# EAGLE design STorM32 NT imu v11-mpu9250 (EAGLE 6.5.0)
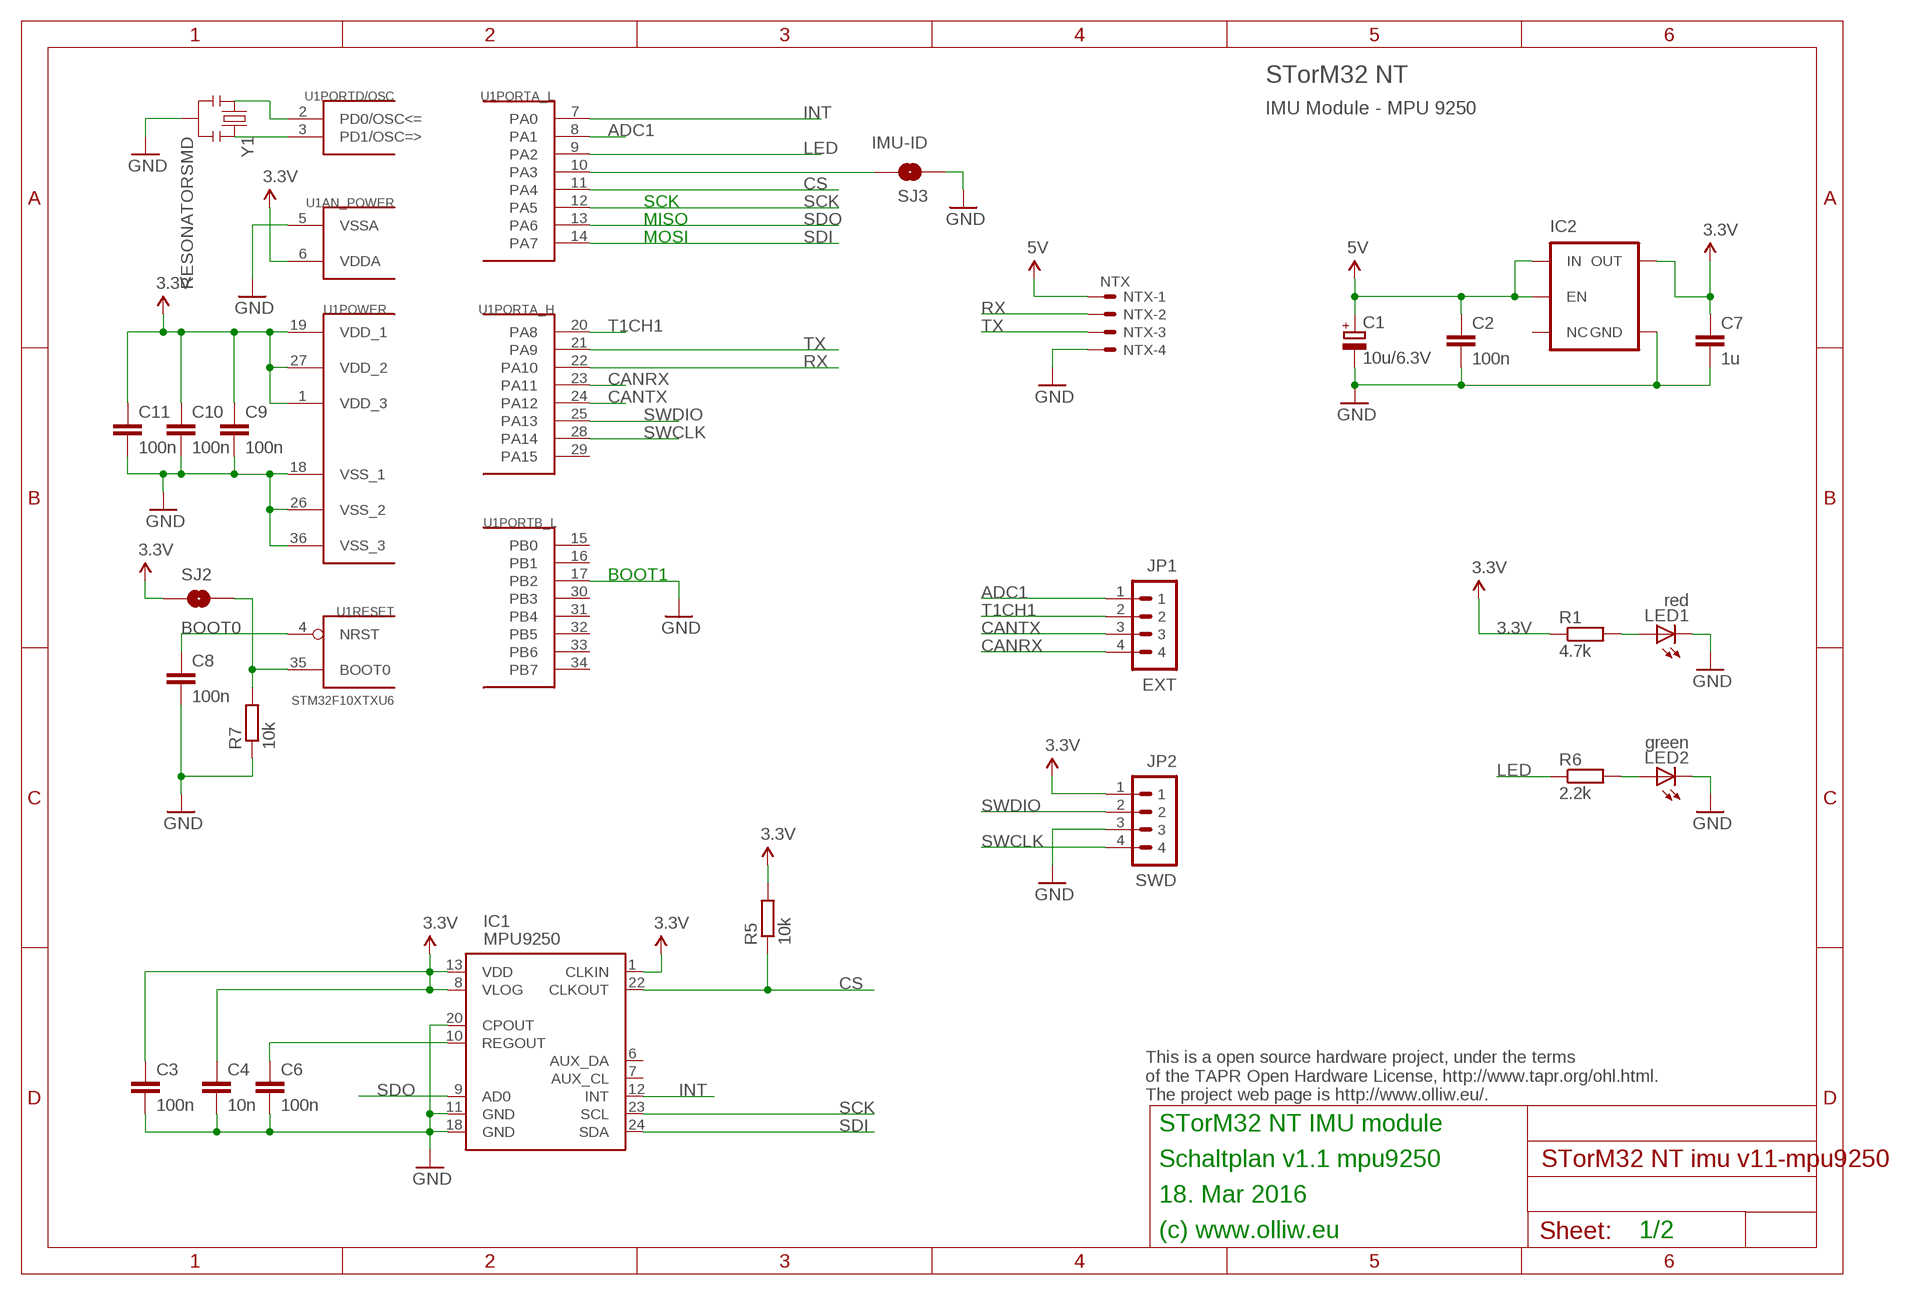
[diagram p0: schematic, sheet 1]

## Parts
C1  10u/6.3V  CPOL-EUSMCB  [SMC_B]
C2  100n  C-EUC0603  [C0603]
C3  100n  C-EUC0603  [C0603]
C4  10n  C-EUC0603  [C0603]
C6  100n  C-EUC0603  [C0603]
C7  1u  C-EUC0603  [C0603]
C8  100n  C-EUC0603  [C0603]
C9  100n  C-EUC0603  [C0603]
C10  100n  C-EUC0603  [C0603]
C11  100n  C-EUC0603  [C0603]
IC1  MPU9250  IMU3000QFN-24-0.4MIL  [QFN-24-3X3]
IC2  V_REG_TPS76433SOT23-5  [SOT23-5]
JP1  EXT  P4X1_1P27-OCT_BILEX  [4X1_1P27_OCT_BILEX]
JP2  SWD  P4X1_1P27-OCT_BILEX  [4X1_1P27_OCT_BILEX]
LED1  red  LEDCHIPLED_0603  [CHIPLED_0603]
LED2  green  LEDCHIPLED_0603  [CHIPLED_0603]
NTX  NTX  SM04B-SRSS-TB  [SM04B-SRSS-TB]
R1  4.7k  R-EU_R0603  [R0603]
R5  10k  R-EU_R0603  [R0603]
R6  2.2k  R-EU_R0603  [R0603]
R7  10k  R-EU_R0603  [R0603]
SJ2  BOOT0  SOLDERJUMPERNO  [SJ_2S-NO]
SJ3  IMU-ID  SOLDERJUMPERNO  [SJ_2S-NO]
U1  STM32F10XTXU6  [VFQFPN36]
Y1  RESONATORSMD  [RESONATOR-SMD]

## Nets
3.3V: C3.1 C4.1 C7.1 C9.1 C10.1 C11.1 IC1.1(CLKIN) IC1.8(VLOG) IC1.13(VDD) IC2.5(OUT) JP2.1 R1.1 R5.2 SJ2.1 U1.1(POWER:VDD_3) U1.6(AN_POWER:VDDA) U1.19(POWER:VDD_1) U1.27(POWER:VDD_2)
5V: C1.+ C2.1 IC2.1(IN) IC2.3(EN) NTX.1
ADC1: JP1.1 U1.8(PORTA_L:PA1)
CANRX: JP1.4 U1.23(PORTA_H:PA11)
CANTX: JP1.3 U1.24(PORTA_H:PA12)
CS: IC1.22(CLKOUT) R5.1 U1.11(PORTA_L:PA4)
GND: C1.- C2.2 C3.2 C4.2 C6.2 C7.2 C8.2 C9.2 C10.2 C11.2 IC1.11(GND) IC1.18(GND) IC1.20(CPOUT) IC2.2(GND) JP2.3 LED1.C LED2.C NTX.4 R7.1 SJ3.1 U1.5(AN_POWER:VSSA) U1.17(PORTB_L:PB2) U1.18(POWER:VSS_1) U1.26(POWER:VSS_2) U1.36(POWER:VSS_3) Y1.2
INT: IC1.12(INT) U1.7(PORTA_L:PA0)
LED: R6.1 U1.9(PORTA_L:PA2)
N$1: C8.1 U1.4(RESET:NRST)
N$2: LED2.A R6.2
N$3: R7.2 SJ2.2 U1.35(RESET:BOOT0)
N$4: SJ3.2 U1.10(PORTA_L:PA3)
N$5: U1.2(PORTD/OSC:PD0/OSC<=) Y1.1
N$6: U1.3(PORTD/OSC:PD1/OSC=>) Y1.3
N$9: LED1.A R1.2
N$20: C6.1 IC1.10(REGOUT)
RX: NTX.2 U1.22(PORTA_H:PA10)
SCK: IC1.23(SCL) U1.12(PORTA_L:PA5)
SDI: IC1.24(SDA) U1.14(PORTA_L:PA7)
SDO: IC1.9(AD0) U1.13(PORTA_L:PA6)
SWCLK: JP2.4 U1.28(PORTA_H:PA14)
SWDIO: JP2.2 U1.25(PORTA_H:PA13)
T1CH1: JP1.2 U1.20(PORTA_H:PA8)
TX: NTX.3 U1.21(PORTA_H:PA9)
Unconnected: IC1.6(AUX_DA) IC1.7(AUX_CL) IC2.4(NC) U1.15(PORTB_L:PB0) U1.16(PORTB_L:PB1) U1.29(PORTA_H:PA15) U1.30(PORTB_L:PB3) U1.31(PORTB_L:PB4) U1.32(PORTB_L:PB5) U1.33(PORTB_L:PB6) U1.34(PORTB_L:PB7)

## Notes on the sheet
- STorM32 NT
- IMU Module - MPU 9250
- SCK
- MISO
- MOSI
- BOOT1
- This is a open source hardware project, under the terms
  of the TAPR Open Hardware License, http://www.tapr.org/ohl.html.
  The project web page is http://www.olliw.eu/.
- STorM32 NT IMU module
- Schaltplan v1.1 mpu9250
- 18. Mar 2016
- (c) www.olliw.eu | 1/2

## Library data of the parts
C1 = rcl:CPOL-EU: POLARIZED CAPACITOR, European symbol
C2-C4 C6-C11 = rcl:C-EU: CAPACITOR, European symbol
IC1 = # SparkFun2:IMU3000
IC2 = # SparkFun2:V_REG_TPS76433: Voltage Regulator Older TI part. LDO 150mA regulator. No output by-pass cap option. See V_REG_LDO for a better part.
JP1 JP2 = # stdlib:P4X1_1P27
LED1 LED2 = led:LED: LED OSRAM: - CHIPLED LG R971, LG N971, LY N971, LG Q971, LY Q971, LO R971, LY R971 LH N974, LH R974 LS Q976, LO Q976, LY Q976 LO Q996 - Hyper CHIPLED LW Q18S LB Q993, LB Q99A, LB R99A - SideLED LS A670, LO A670, LY A670, LG A670, LP A670 LB A673, LV A673, LT A673, LW A673 LH A674 LY A675 LS A676, LA A676, LO A676, LY A676, LW A676 LS A679, LY A679, LG A679 - Hyper Micro SIDELED® LS Y876, LA Y876, LO Y876, LY Y876 LT Y87S - SmartLED LW L88C, LW L88S LB L89C, LB L89S, LG L890 LS L89K, LO L89K, LY L89K LS L896, LA L896, LO L896, LY L896 - TOPLED LS T670, LO T670, LY T670, LG T670, LP T670 LSG T670, LSP T670, LSY T670, LOP T670, LYG T670 LG T671, LOG T671, LSG T671 LB T673, LV T673, LT T673, LW T673 LH T674 LS T676, LA T676, LO T676, LY T676, LB T676, LH T676, LSB T676, LW T676 LB T67C, LV T67C, LT T67C, LS T67K, LO T67K, LY T67K, LW E67C LS E67B, LA E67B, LO E67B, LY E67B, LB E67C, LV E67C, LT E67C LW T67C LS T679, LY T679, LG T679 LS T770, LO T770, LY T770, LG T770, LP T770 LB T773, LV T773, LT T773, LW T773 LH T774 LS E675, LA E675, LY E675, LS T675 LS T776, LA T776, LO T776, LY T776, LB T776 LHGB T686 LT T68C, LB T68C - Hyper Mini TOPLED® LB M676 - Mini TOPLED Santana® LG M470 LS M47K, LO M47K, LY M47K Source: http://www.osram.convergy.de LUXEON: - LUMILED® LXK2-PW12-R00, LXK2-PW12-S00, LXK2-PW14-U00, LXK2-PW14-V00 LXK2-PM12-R00, LXK2-PM12-S00, LXK2-PM14-U00 LXK2-PE12-Q00, LXK2-PE12-R00, LXK2-PE12-S00, LXK2-PE14-T00, LXK2-PE14-U00 LXK2-PB12-K00, LXK2-PB12-L00, LXK2-PB12-M00, LXK2-PB14-N00, LXK2-PB14-P00, LXK2-PB14-Q00 LXK2-PR12-L00, LXK2-PR12-M00, LXK2-PR14-Q00, LXK2-PR14-R00 LXK2-PD12-Q00, LXK2-PD12-R00, LXK2-PD12-S00 LXK2-PH12-R00, LXK2-PH12-S00 LXK2-PL12-P00, LXK2-PL12-Q00, LXK2-PL12-R00 Source: www.luxeon.com KINGBRIGHT: KA-3528ASYC Source: www.kingbright.com
NTX = con-jst2:?M04B-SRSS-TB: Disconnectable Crimp style connector, 1.0mm pitch 4 contacts
R1 R5-R7 = rcl:R-EU_: RESISTOR, European symbol
SJ2 SJ3 = # SparkFun2:SOLDERJUMPER: Solder Jumper Standard SMD solder jumper. Used to automate production. Two varients : Normally Open and Normally Closed are the same, but have different paste layers. NC will have a large amount of paste and should jumper during reflow.
U1 = # stm32:STM32F10XTXU6: STM32F101/103 36pad VFQPFN36
Y1 = # SparkFun2:RESONATOR: Resonator Small SMD resonator. This is the itty bitty 10/20MHz resonators with built in caps. CSTCE10M0G55 and CSTCE20M0V53. Footprint has been reviewed closely but hasn't been tested yet.

## Board
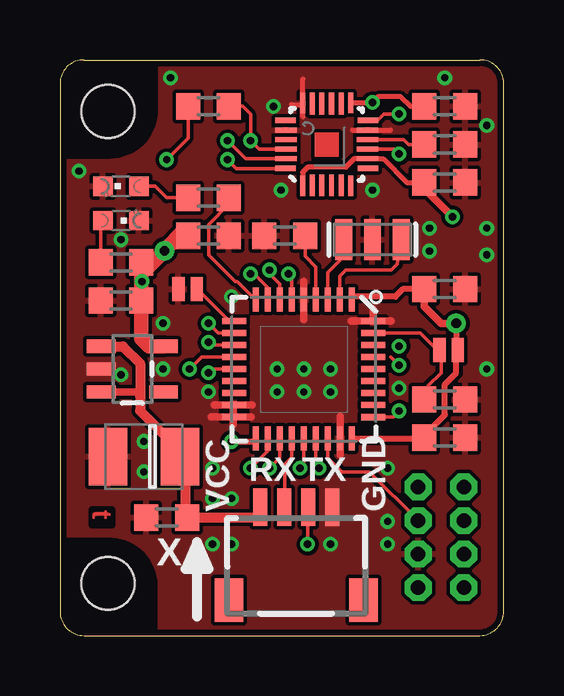
[diagram p1: board, top side]
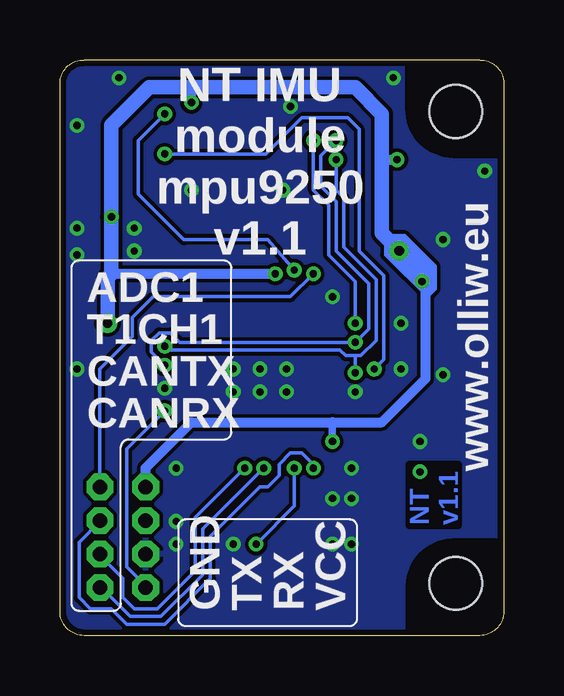
[diagram p2: board, bottom side, seen from below]

Size 18.49 x 24 mm. Coordinates in mm from the lower left corner, seen from the top.
Outline: 1,24 17.49,24 arc-90 18.49,23.03 18.49,1 arc-90 17.49,0 1,0 arc-90 0,1 0,23.03 arc-90 1,24
Copper layers (1*16): Top 0.035mm / dielectric 1.5mm / Bottom 0.035mm
Design rules "Fusion_eagle_rule_v1.1-shapes-supply-changed": minimum track width 6mil, minimum drill 12mil, track to track 6mil, track to pad 6mil, pad to pad 6mil, via to via 6mil, smd to smd 0mil, copper to edge 10mil, drill to drill 10mil, minimum pad ring 10mil, minimum via ring 6mil, stop-mask expansion 2mil, vias tented up to drill 100mil, thermal gap 6mil
Holes 2.2 mm at 2,2.17 2,21.86

### Footprints (pad centres in the part's own frame; a part is rotated, then mirrored left to right if it is on the bottom)
SMC_B = smd 1.6 x 2.4: + -1.5,0; - 1.5,0
C0603 = smd 1 x 1.1: 1 -0.85,0; 2 0.85,0
QFN-24-3X3 = smd 0.85 x 0.21: 1 -1.725,1; 6 -1.725,-1; 13 1.725,-1; 18 1.725,1 | smd 0.9 x 0.21: 2 -1.7,0.6; 3 -1.7,0.2; 5 -1.7,-0.6; 14 1.7,-0.6; 15 1.7,-0.2; 16 1.7,0.2; 17 1.7,0.6 | smd 0.9 x 0.2: 4 -1.7,-0.2 | smd 0.21 x 0.85: 7 -1,-1.725; 12 1,-1.725; 19 1,1.725; 24 -1,1.725 | smd 0.21 x 0.9: 8 -0.6,-1.7; 9 -0.2,-1.7; 10 0.2,-1.7; 11 0.6,-1.7; 20 0.6,1.7; 21 0.2,1.7; 22 -0.2,1.7; 23 -0.6,1.7
SOT23-5 = smd 0.55 x 1.2: 1 -0.95,-1.3; 2 0,-1.3; 3 0.95,-1.3; 4 0.95,1.3; 5 -0.95,1.3
4X1_1P27_OCT_BILEX = drill 0.61 pad 1.118 octagon: 1 0,0; 2 0,-1.397; 3 0,-2.794; 4 0,-4.191
CHIPLED_0603 = smd 0.8 x 0.8: A 0,-0.75; C 0,0.75
SM04B-SRSS-TB = smd 0.6 x 1.55: 1 -1.5,2.975; 2 -0.5,2.975; 3 0.5,2.975; 4 1.5,2.975 | smd 1.2 x 1.8: FIT@1 -2.8,-0.9; FIT@2 2.8,-0.9
R0603 = smd 1 x 1.1: 1 -0.85,0; 2 0.85,0
SJ_2S-NO = smd 0.508 x 1.016: 1 -0.381,0; 2 0.381,0
VFQFPN36 = smd 1 x 0.25: 1 -2.9,2; 2 -2.9,1.5; 3 -2.9,1; 4 -2.9,0.5; 5 -2.9,0; 6 -2.9,-0.5; 7 -2.9,-1; 8 -2.9,-1.5; 9 -2.9,-2; 19 2.9,-2; 20 2.9,-1.5; 21 2.9,-1; 22 2.9,-0.5; 23 2.9,0; 24 2.9,0.5; 25 2.9,1; 26 2.9,1.5; 27 2.9,2 | smd 0.25 x 1: 10 -2,-2.9; 11 -1.5,-2.9; 12 -1,-2.9; 13 -0.5,-2.9; 14 0,-2.9; 15 0.5,-2.9; 16 1,-2.9; 17 1.5,-2.9; 18 2,-2.9; 29 1.5,2.9; 30 1,2.9; 31 0.5,2.9; 32 0,2.9; 33 -0.5,2.9; 34 -1,2.9; 35 -1.5,2.9; 36 -2,2.9 | smd 0.27 x 1: 28 2,2.9
RESONATOR-SMD = smd 0.7 x 1.7: 1 -1.2,0; 2 0,0; 3 1.2,0

### Placement (x,y rotation side)
C1  3.49,7.46 180 top
C2  4.45,4.92 180 top
C3  16.03,22.07 0 top
C4  16.03,18.89 0 top
C6  16.03,20.48 0 top
C7  2.54,13.97 180 top
C8  9.37,16.67 180 top
C9  16.03,8.26 0 top
C10  6.19,16.67 0 top
C11  16.03,14.45 0 top
IC1  11.11,20.48 90 top
IC2  3.02,11.11 270 top
JP1  16.83,6.19 0 top
JP2  14.92,6.19 0 top
LED1  2.54,17.3 270 top
LED2  2.54,18.73 90 top
NTX  9.84,2.38 0 top
R1  2.54,15.56 180 top
R5  6.19,22.07 180 top
R6  6.19,18.26 180 top
R7  16.03,9.84 180 top
SJ2  16.19,11.91 180 top
SJ3  5.32,14.45 0 top
U1  10.16,11.11 270 top
Y1  13.02,16.51 180 top

### Tracks (layer width: path | path; a pad name or v marks a point on that pad's centre or on a via)
3.3V  (via drill 0.3, 0.4 pad 0.81)
  Top 0.152: 12.2,14.13 U1.1 | 15.34,8.21 C9.1 | 3.4,13.49 C7.1 | 16.51,11.34 SJ2.1 16.51,12 | 8.04,8.1 U1.19 | U1.6 9.66,14.95 v9.53,15.08 | 3.56,15.26 3.39,15.24 | v4.45,19.84 5.34,20.74 R5.2 | IC1.13 12.13,22.23
  Top 0.203: IC1.1 10.11,19.32 10.32,19.53 11.91,19.53 12.26,19.88 IC1.8 13.46,19.88 14.45,18.89 C4.1 | C3.1 14.61,22.07 14.21,22.46 13.26,22.46 v13.02,22.23 12.13,22.23
  Top 0.254: C11.1 14.29,14.45 13.97,14.13 12.2,14.13 | U1.27 15.34,8.21 15.34,8.52 16.03,9.21 16.03,10.48 16.51,10.95 16.51,11.34 16.51,12 v16.51,13.02 | v7.14,8.1 8.04,8.1
  Top 0.305: C11.1 15.18,13.71 15.88,13.02 v16.51,13.02 | v16.35,17.46 15.18,18.63 C4.1
  Top 0.406: C7.1 3.33,14.76 v3.41,14.76
  Top 0.61: R1.1 3.39,15.24 C7.1 3.39,12.39 3.72,12.06 IC2.5 | 3.56,15.26 v4.36,16.05 5.16,16.91 5.25,16.52 C10.1
  Bottom 0.152: 16.19,15.08 16.35,15.08 | 3.25,14.53 3.25,14.95 v4.36,16.05 | 2.86,14.61 2.86,14.45 3.17,14.13 4.92,15.88 4.92,16.35 4.6,16.67 4.13,16.67 2.86,15.4 2.86,14.61 | 3.17,14.45 3.02,14.45 2.86,14.61
  Bottom 0.254: 3.17,14.13 3.25,14.53
  Bottom 0.305: v7.14,8.1 7.14,8.89
  Bottom 0.406: 3.25,14.53 3.25,10.72 5.08,8.89 7.14,8.89 13.02,8.89 14.92,6.99 JP2.1 | v9.53,15.08 16.19,15.08 | 5.08,19.84 v4.45,19.84 | v16.35,17.46 16.35,17.14 | v13.02,22.23 13.02,22.86 | 3.02,15.24 4.29,16.51 4.45,16.35 4.76,16.19 4.76,16.03 3.17,14.45 3.02,14.61 | 3.02,14.61 3.02,14.92 4.13,16.03 4.29,15.88 3.02,14.61
  Bottom 0.61: v16.51,13.02 16.51,14.92 16.35,15.08 16.35,17.14 16.35,21.27 14.76,22.86 13.02,22.86 6.19,22.86 5.08,21.75 5.08,19.84 5.08,16.77 v4.36,16.05
5V
  Top 0.152: C2.1 5.24,4.76 | 5.24,7.85 C1.+ 4.92,7.37 4.92,7.78 | 3.33,10.16 3.33,10 | 8.26,4.92 8.41,4.92 | 8.26,5.11 NTX.1
  Top 0.305: IC2.3 3.33,10.16 | 8.41,4.92 8.26,5.11
  Top 0.406: 5.24,4.76 5.24,7.85 | IC2.1 2.62,12.06 3.33,11.35 3.33,10 3.33,9.37 4.92,7.78 | C2.1 8.26,4.92
ADC1  (via drill 0.3)
  Top 0.152: U1.8 8.66,14.52 8.1,15.08 v7.94,15.08
  Bottom 0.152: JP1.1 16.83,11.11 15.48,12.46 15.48,13.26 14.61,14.13 8.89,14.13 v7.94,15.08
CANRX  (via drill 0.3)
  Top 0.152: v10,6.99 10.16,7.14 U1.23
  Bottom 0.152: v10,6.99 12.54,4.45 12.54,2.54 14.29,0.79 15.56,0.79 16.51,1.75 16.73,1.75 JP1.4
CANTX  (via drill 0.3)
  Top 0.152: U1.24 10.66,7.12 v10.79,6.99
  Bottom 0.152: v10.79,6.99 12.86,4.92 12.86,2.7 14.45,1.11 15.4,1.11 15.88,1.59 15.88,2.38 16.73,3.24 JP1.3
CS  (via drill 0.3)
  Top 0.152: U1.11 6.6,12.61 v6.19,13.02 | 6.99,21.96 R5.1 7.62,22.07 7.94,21.75 v7.94,20.64 8.3,20.28 IC1.22
  Bottom 0.152: v6.19,13.02 6.19,14.76 7.3,15.88 7.3,17.94 7.94,18.57 v7.94,20.64
GND  (via drill 0.3 pad 0.61)
  Top 0.152: U1.17 7.26,9.48 7.22,9.45
  Top 0.203: 12.18,21.07 13.77,21.07 | 10.12,21.63 10.12,23.22 | 9.64,22.15 10.08,22.15
  Top 0.305: 10.16,14.76 10.16,13.18 | 13.81,13.11 12.14,13.11 | 6.43,9.6 8.02,9.6 | 6.31,9.12 7.98,9.12 | 11.67,9.13 11.67,7.54 | 13.06,13.18 13.06,13.61 | 7.22,8.81 7.22,9.45
  other vias: 2.54,16.51 9.05,11.11 11.27,11.11 10.16,11.11 9.05,10.16 10.16,10.16 11.27,10.16 7.14,14.13 9.21,18.57 13.02,18.57 13.65,6.99 6.35,6.99 3.49,8.1 3.49,6.83 0.79,19.37 13.65,3.81 14.13,10.32 11.27,3.81 7.14,3.81 6.35,3.81 4.29,11.11 15.4,16.03 17.78,15.88 15.4,16.99 7.14,5.71 6.35,5.71 6.19,10.16 13.65,4.76 17.78,16.99 17.78,11.11 4.29,13.02 2.54,10.87 17.78,21.27 8.89,22.07 4.6,23.26 16.03,23.26
  pour Bottom (isolate 0.152): 0.33,23.03 arc-90 1,23.7 17.49,23.7 arc-90 18.16,23.03 18.16,1 arc-90 17.49,0.33 1,0.33 arc-90 0.33,1
  pour Top (isolate 0.152): 0.33,23.03 arc-90 1,23.7 17.49,23.7 arc-90 18.16,23.03 18.16,1 arc-90 17.49,0.33 1,0.33 arc-90 0.33,1
  cutout Bottom: 0.27,19.91 2.12,19.91 arc90 4.08,21.97 4.08,23.72 1.02,23.72 arc90 0.27,22.97
  cutout Top: 0.27,19.91 2.12,19.91 arc90 4.08,21.97 4.08,23.72 1.02,23.72 arc90 0.27,22.97
  cutout Bottom: 4.06,0.25 4.06,2.1 arc90 2,4.06 0.25,4.06 0.25,1 arc90 1,0.25
  cutout Top: 4.06,0.25 4.06,2.1 arc90 2,4.06 0.25,4.06 0.25,1 arc90 1,0.25
  pour Top (no thermals): 10.95,6.35 11.91,6.35 11.91,4.13 10.95,4.13
  pour Top (no thermals): 0.95,11.59 2.54,11.59 2.54,10.72 0.95,10.72
INT  (via drill 0.3)
  Top 0.152: U1.7 9.16,14.65 8.73,15.08 v8.73,15.24 | IC1.12 13.22,21.48 13.49,21.75 v14.13,21.75
  Bottom 0.152: v8.73,15.24 9.84,16.51 13.34,16.51 15.24,18.41 15.24,20.64 v14.13,21.75
LED
  Top 0.152: R6.1 7.04,18 6.19,17.14 6.19,15.88 7.3,14.76 7.38,14.76 8.13,14.01 U1.9
N$1
  Top 0.152: U1.4 10.66,15.38 10.22,15.82 C8.1
N$2
  Top 0.152: R6.2 4.45,18.26 3.97,18.73 LED2.A
N$3
  Top 0.152: U1.35 15.01,12.61 15.88,11.75 | 15.88,11.75 SJ2.2 | R7.2 15.34,10.42 15.88,10.95 15.88,11.75
N$4
  Top 0.152: U1.10 7.05,13.11 5.86,14.3 SJ3.2
N$5
  Top 0.152: U1.2 11.66,14.99 11.91,15.24 13.81,15.24 14.06,15.49 Y1.1
N$6
  Top 0.152: U1.3 11.16,15.13 11.66,15.63 Y1.3
N$9
  Top 0.152: LED1.A 1.69,17.2 R1.2
N$20
  Top 0.152: IC1.10 14.33,20.68 14.53,20.48 C6.1
RX
  Top 0.152: U1.22 9.66,7.44 9.37,7.14 9.37,5.22 NTX.2
SCK  (via drill 0.3)
  Top 0.152: 13.79,11.61 v14.13,11.27 | U1.12 6.3,12.11 v6.19,12.22 | IC1.23 7.74,19.88 v6.99,20.64
  Bottom 0.152: v14.13,11.27 14.68,11.83 14.68,12.3 14.37,12.62 13.89,12.62 13.49,12.22 v6.19,12.22 5.64,12.78 5.64,14.68 6.99,16.03 6.99,18.1 7.62,18.73 7.62,20 v6.99,20.64
SDI  (via drill 0.3)
  Top 0.152: 14.08,12.11 v14.13,12.06 | U1.14 6.35,11.11 v6.19,10.95 | IC1.24 7.35,19.48 v6.99,19.84
  Bottom 0.152: v14.13,12.06 13.97,11.91 6.83,11.91 6.59,11.67 6.19,11.67 | 6.19,11.67 5.95,11.67 5.32,12.3 5.32,14.84 6.67,16.19 6.67,18.26 6.99,18.57 v6.99,19.84 | v6.19,10.95 6.19,11.67
SDO  (via drill 0.3)
  Top 0.152: U1.13 5.9,11.61 v5.4,11.11 | IC1.9 13.93,20.28 v14.13,20.08
  Bottom 0.152: v5.4,11.11 5,11.51 5,15 6.03,16.03 6.03,21.11 6.51,21.59 8.41,21.59 9.92,20.08 v14.13,20.08
SWCLK  (via drill 0.3)
  Top 0.152: U1.28 13.91,9.11 v14.13,9.37
  Bottom 0.152: JP2.4 14.92,2.06 15.72,2.86 15.72,7.78 v14.13,9.37
SWDIO
  Top 0.152: U1.25 11.16,7.41 11.75,6.83 12.89,6.83 JP2.2
T1CH1  (via drill 0.3)
  Top 0.152: v7.94,6.99 8.66,7.71 U1.20
  Bottom 0.152: JP1.2 16.83,4.76 17.7,3.89 17.7,1.59 17.22,1.11 16.35,1.11 15.72,0.48 14.13,0.48 12.22,2.38 12.22,4.13 10.16,6.19 9.84,6.19 9.37,6.67 9.37,7.14 8.89,7.62 8.41,7.62 7.94,7.14 v7.94,6.99
TX  (via drill 0.3)
  Top 0.152: U1.21 9.16,7.41 v8.73,6.99 | v10.32,3.81 10.32,5.17 NTX.3
  Bottom 0.152: v8.73,6.99 8.73,5.4 v10.32,3.81

### Text on the board
Top: t
Bottom: NT / v1.1
tNames: RX | TX | VCC | GND | X
bNames: www.olliw.eu | NT IMU / module / mpu9250 / v1.1 | ADC1 | T1CH1 | CANTX | CANRX | VCC | RX | TX | GND